# EAGLE design Jonah (EAGLE 6.2)
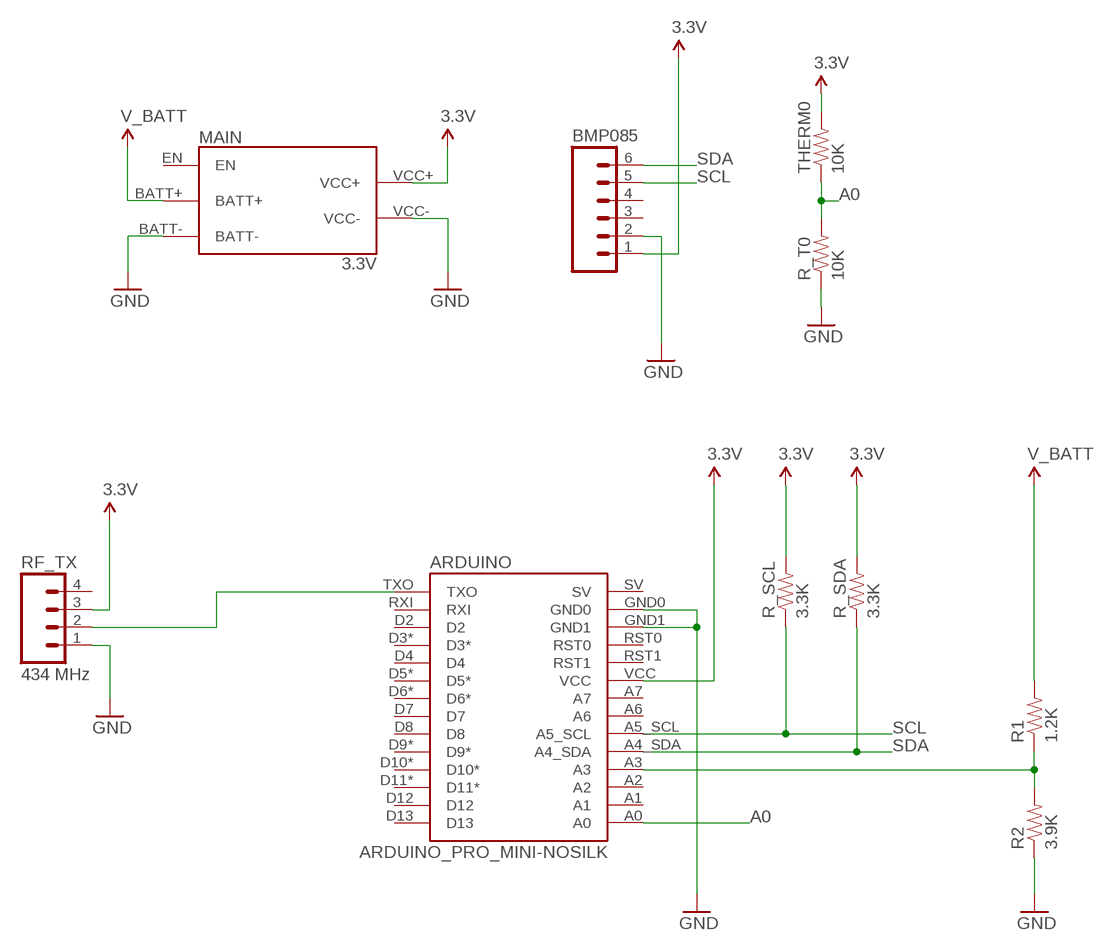
[diagram p0: schematic, sheet 1]

## Parts
ARDUINO  ARDUINO_PRO_MINI-NOSILK  [ARDUINO_PRO_MINI-NOSILK]
BMP085  M06SIP  [1X06]
MAIN  3.3V  POWER-TPS6300X-NOSILK  [POWER-TPS6300X-NOSILK]
R1  1.2K  RESISTOR0805-RES  [0805]
R2  3.9K  RESISTOR0805-RES  [0805]
R_SCL  3.3K  RESISTOR0805-RES  [0805]
R_SDA  3.3K  RESISTOR0805-RES  [0805]
R_T0  10K  RESISTOR0805-RES  [0805]
RF_TX  434 MHz  M04PTH  [1X04]
THERM0  10K  RESISTOR0805-RES  [0805]

## Nets
1.8V: MAIN.BATT+ R1.2 ; supply symbol labelled V_BATT
3.3V: ARDUINO.VCC BMP085.1 MAIN.VCC+ R_SCL.2 R_SDA.2 RF_TX.3 THERM0.2
A0: ARDUINO.A0 R_T0.2 THERM0.1
GND: ARDUINO.GND0 ARDUINO.GND1 BMP085.2 MAIN.BATT- MAIN.VCC- R2.1 R_T0.1 RF_TX.1
N$1: ARDUINO.TXO RF_TX.2
N$2: ARDUINO.A3 R1.1 R2.2
SCL: ARDUINO.A5_SCL BMP085.5 R_SCL.1
SDA: ARDUINO.A4_SDA BMP085.6 R_SDA.1
Unconnected: ARDUINO.A1 ARDUINO.A2 ARDUINO.A6 ARDUINO.A7 ARDUINO.D2 ARDUINO.D3* ARDUINO.D4 ARDUINO.D5* ARDUINO.D6* ARDUINO.D7 ARDUINO.D8 ARDUINO.D9* ARDUINO.D10* ARDUINO.D11* ARDUINO.D12 ARDUINO.D13 ARDUINO.RST0 ARDUINO.RST1 ARDUINO.RXI ARDUINO.SV BMP085.3 BMP085.4 MAIN.EN RF_TX.4

## Library data of the parts
ARDUINO = OpenSpace:ARDUINO_PRO_MINI
BMP085 = SparkFun:M06: Header 6 Standard 6-pin 0.1" header. Use with straight break away headers (SKU : PRT-00116), right angle break away headers (PRT-00553), swiss pins (PRT-00743), machine pins (PRT-00117), and female headers (PRT-00115). Molex polarized connector foot print use with SKU : PRT-08094 with associated crimp pins and housings. NOTES ON THE VARIANTS LOCK and LOCK_LONGPADS... This footprint was designed to help hold the alignment of a through-hole component (i.e. 6-pin header) while soldering it into place. You may notice that each hole has been shifted either up or down by 0.005 of an inch from it's more standard position (which is a perfectly straight line). This slight alteration caused the pins (the squares in the middle) to touch the edges of the holes. Because they are alternating, it causes a "brace" to hold the component in place. 0.005 has proven to be the perfect amount of "off-center" position when using our standard breakaway headers. Although looks a little odd when you look at the bare footprint, once you have a header in there, the alteration is very hard to notice. Also, if you push a header all the way into place, it is covered up entirely on the bottom side. This idea of altering the position of holes to aid alignment will be further integrated into the Sparkfun Library for other footprints. It can help hold any component with 3 or more connection pins.
MAIN = OpenSpace:POWER
R1 R2 R_SCL R_SDA R_T0 THERM0 = SparkFun-Passives:RESISTOR: Resistor Basic schematic elements and footprints for 0603, 1206, and PTH resistors.
RF_TX = SparkFun-Connectors:M04: Header 4 Standard 4-pin 0.1" header. Use with straight break away headers (SKU : PRT-00116), right angle break away headers (PRT-00553), swiss pins (PRT-00743), machine pins (PRT-00117), and female headers (PRT-00115). Molex polarized connector foot print use with SKU : PRT-08231 with associated crimp pins and housings. 1MM SMD Version SKU: PRT-10208

## Board
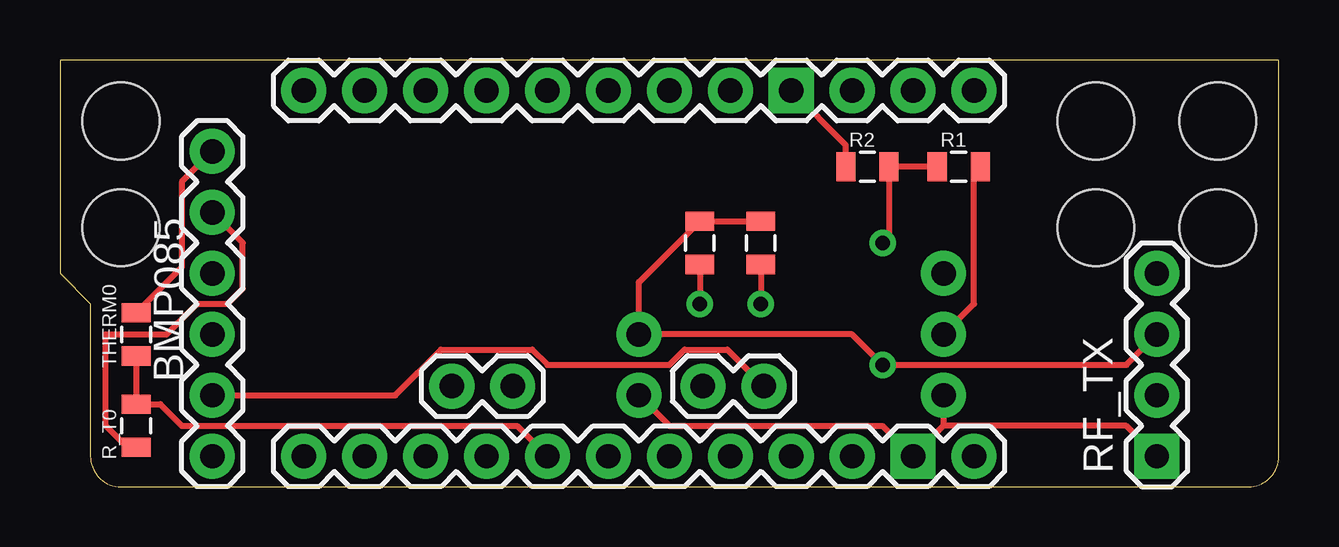
[diagram p1: board, top side]
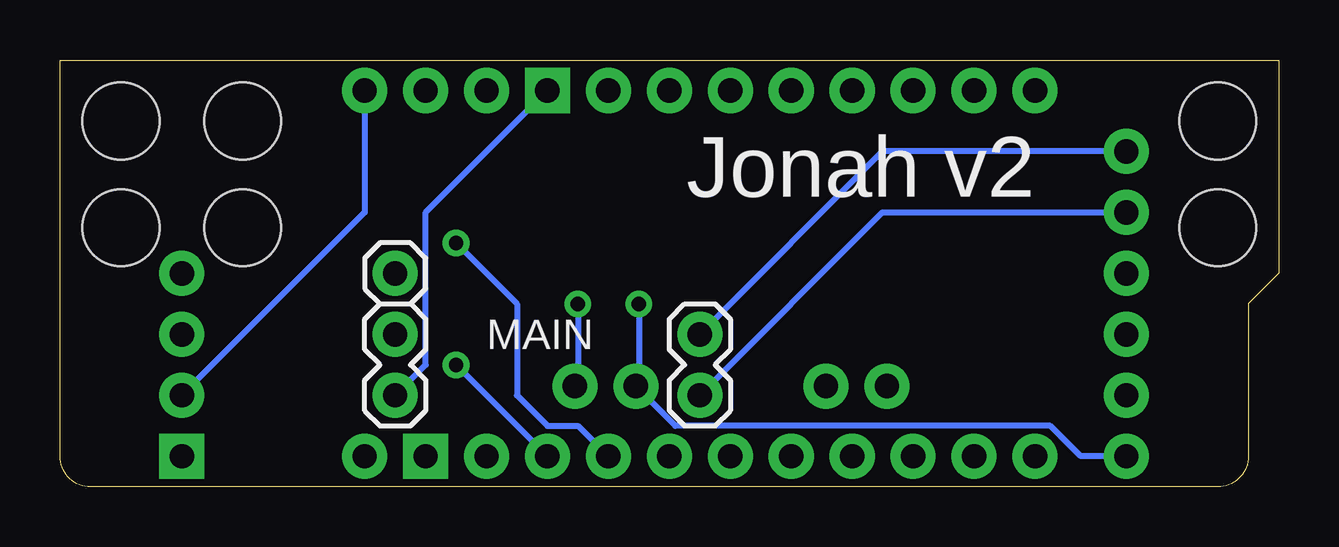
[diagram p2: board, bottom side, seen from below]

Size 50.8 x 17.78 mm. Coordinates in mm from the lower left corner, seen from the top.
Outline: 0,17.78 0,8.89 1.27,7.62 1.27,1.27 arc90 2.54,0 49.53,0 arc90 50.8,1.27 50.8,17.78 0,17.78
Copper layers (1*16): Top 0.035mm / dielectric 1.5mm / Bottom 0.035mm
Design rules: minimum track width 8mil, minimum drill 20mil, track to track 8mil, track to pad 8mil, pad to pad 8mil, via to via 8mil, smd to smd 8mil, copper to edge 10mil, drill to drill 8mil, minimum pad ring 12mil, minimum via ring 10mil, stop-mask expansion 4mil, vias tented up to drill 25mil, thermal gap 10mil
Holes 3.2 mm at 2.54,10.79 43.18,10.79 48.26,10.79 2.54,15.24 48.26,15.24 43.18,15.24

### Footprints (pad centres in the part's own frame; a part is rotated, then mirrored left to right if it is on the bottom)
ARDUINO_PRO_MINI-NOSILK = drill 1.016 pad 1.88: A0 7.62,-3.81; A1 7.62,-1.27; A2 7.62,1.27; A3 7.62,3.81; A4_SDA 4.699,2.667; A5_SCL 4.699,5.207; A6 4.699,-7.798; A7 4.699,-5.258; D2 -7.62,3.81; D3* -7.62,1.27; D4 -7.62,-1.27; D5* -7.62,-3.81; D6* -7.62,-6.35; D7 -7.62,-8.89; D8 -7.62,-11.43; D9* -7.62,-13.97; D10* 7.62,-13.97; D11* 7.62,-11.43; D12 7.62,-8.89; D13 7.62,-6.35; RST0 -7.62,8.89; RST1 7.62,8.89; RXI -7.62,11.43; SV 7.62,13.97; TXO -7.62,13.97; VCC 7.62,6.35 | drill 1.016 pad 1.88 square: GND0 -7.62,6.35; GND1 7.62,11.43
1X06 = drill 1.016 pad 1.88: 1 0,0; 2 2.54,0; 3 5.08,0; 4 7.62,0; 5 10.16,0; 6 12.7,0
POWER-TPS6300X-NOSILK = drill 1.016 pad 1.88: BATT+ -2.54,1.27; BATT- -2.54,-1.27; EN -2.54,3.81; VCC+ 10.16,1.27; VCC- 10.16,-1.27
0805 = smd 0.8 x 1.2: 1 -0.9,0; 2 0.9,0
1X04 = drill 1.016 pad 1.88 square: 1 0,0 | drill 1.016 pad 1.88: 2 2.54,0; 3 5.08,0; 4 7.62,0

### Placement (x,y rotation side)
ARDUINO  24.13,8.89 270 top
BMP085  6.35,13.97 270 top
MAIN  34.29,5.08 0 bottom
R1  37.47,13.34 0 top
R2  33.66,13.34 0 top
R_SCL  29.21,10.16 90 top
R_SDA  26.67,10.16 90 top
R_T0  3.17,2.54 90 top
RF_TX  45.72,1.27 90 top
THERM0  3.17,6.35 90 top

### Tracks (layer width: path | path; a pad name or v marks a point on that pad's centre or on a via)
1.8V
  Top 0.254: MAIN.BATT+ 38.1,7.62 38.1,13.07 R1.2
3.3V  (via drill 0.6)
  Top 0.254: BMP085.1 5.08,12.7 5.08,9.15 THERM0.2 | R_SCL.2 R_SDA.2 24.13,8.52 MAIN.VCC+ 33.02,6.35 v34.29,5.08 44.45,5.08 RF_TX.3
  Bottom 0.254: BMP085.1 16.51,13.97 MAIN.VCC+ | ARDUINO.VCC v34.29,5.08
A0
  Top 0.254: THERM0.1 R_T0.2 4.18,3.44 5.08,2.54 19.05,2.54 ARDUINO.A0
GND
  Top 0.254: R_T0.1 2.8,1.64 1.91,2.54 1.91,6.35 4.45,6.35 5.71,7.62 6.98,7.62 7.62,8.26 7.62,10.16 BMP085.2 | MAIN.VCC- 25.4,2.54 34.29,2.54 ARDUINO.GND1 36.83,2.54 | RF_TX.1 44.45,2.54 36.83,2.54 | MAIN.BATT- 36.83,2.54 | R2.1 32.76,14.23 ARDUINO.GND0
  Bottom 0.254: MAIN.VCC- 16.51,11.43 BMP085.2 | MAIN.BATT- 35.56,5.08 35.56,11.43 ARDUINO.GND0
N$1
  Bottom 0.254: ARDUINO.TXO 38.1,11.43 RF_TX.2
N$2  (via drill 0.6)
  Top 0.254: R1.1 R2.2 34.55,10.43 v34.29,10.16
  Bottom 0.254: v34.29,10.16 31.75,7.62 31.75,3.81 30.48,2.54 29.21,2.54 ARDUINO.A3
SCL  (via drill 0.6)
  Top 0.254: R_SCL.1 v29.21,7.62 | BMP085.5 13.97,3.81 15.88,5.71 19.68,5.71 20.32,5.08 25.4,5.08 26.04,5.71 27.81,5.71 ARDUINO.A5_SCL
  Bottom 0.254: v29.21,7.62 29.21,4.32 ARDUINO.A5_SCL
SDA  (via drill 0.6)
  Top 0.254: R_SDA.1 v26.67,7.62
  Bottom 0.254: v26.67,7.62 26.67,4.32 ARDUINO.A4_SDA 25.15,2.54 9.53,2.54 8.26,1.27 BMP085.6

### Text on the board
bPlace: Jonah v2